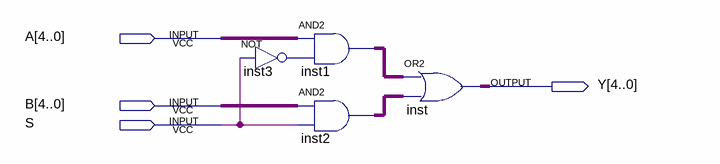
[diagram p0: schematic sheet]
// Quartus schematic 5mux21.bdf as structural Verilog: 4 symbols, 4 pins
module \5mux21  (
  input  [4:0] A,
  input  [4:0] B,
  input  S,
  output [4:0] Y
);

  wire inst3_out;
  wire [4:0] inst1_out, inst2_out;

  assign inst1_out = A & {5{inst3_out}};  // AND2 inst1, 5 bits wide
  not inst3 (inst3_out, S);
  assign inst2_out = B & {5{S}};  // AND2 inst2, 5 bits wide
  assign Y = inst1_out | inst2_out;  // OR2 inst, 5 bits wide
endmodule
